# Altium schematic sheet MAX78630 SOC.SchDoc: MAX78630 SOC Core
size 393 x 292 mm; SheetNumber: 12; SheetTotal: 12
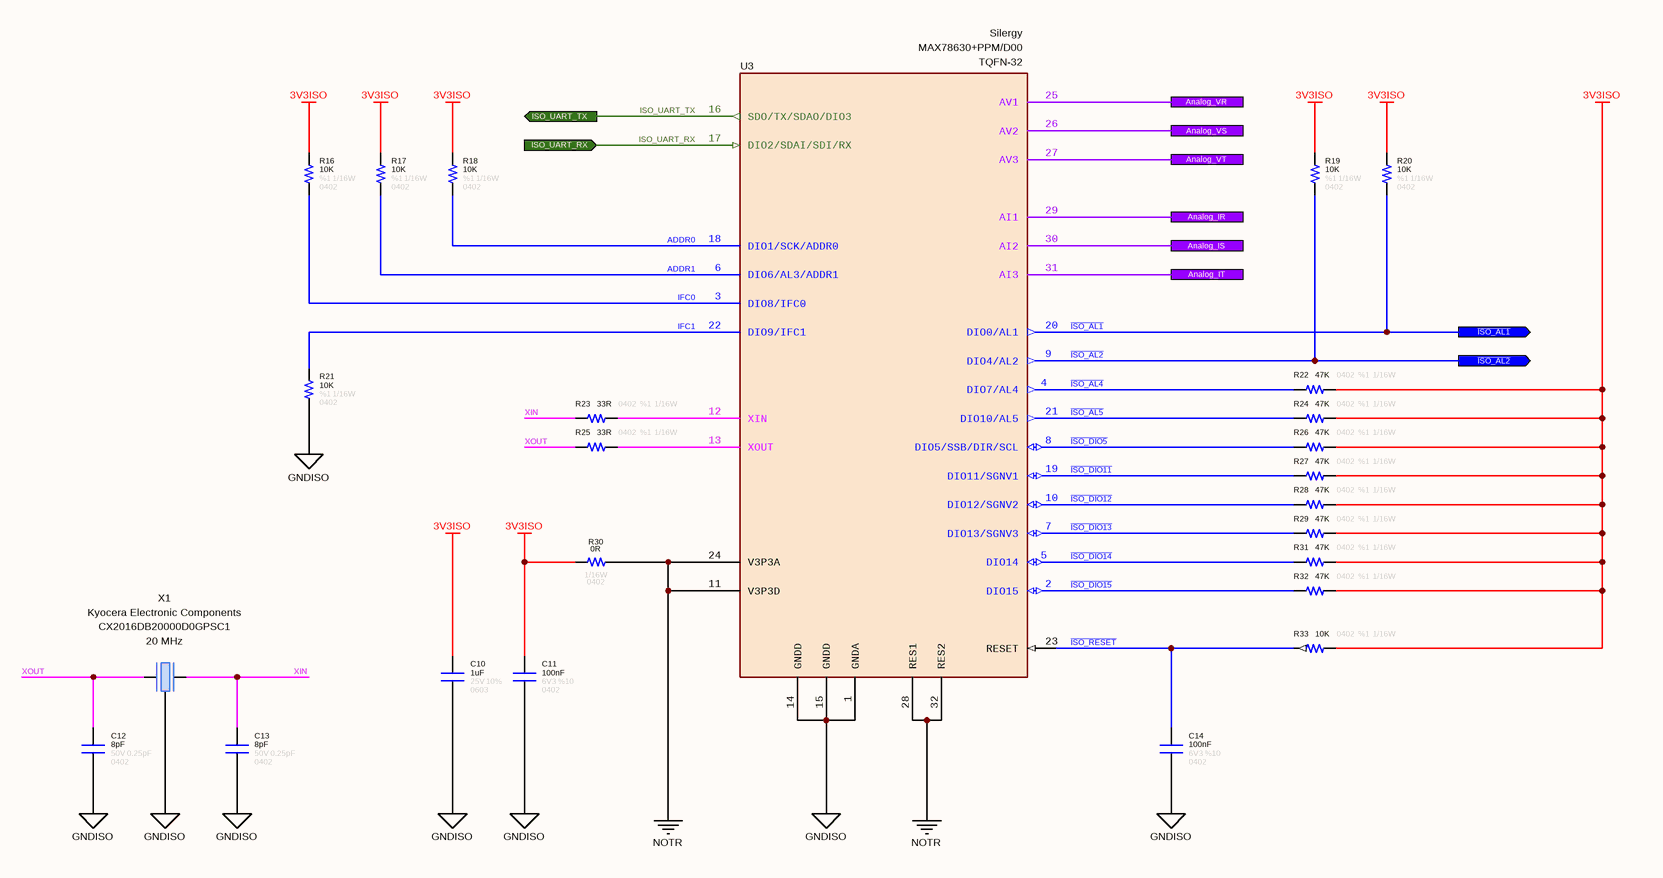
[diagram p0: MAX78630 SOC.SchDoc]

## Parts
C10  value 1uF  Tolerance: 10%  Case: 0603  Voltage: 25V  [CAPACITOR_0603]  (hidden comment: Capacitor - 1uF [0603] (MLCC))
C11  value 100nF  Tolerance: %10  Voltage: 6V3  Case: 0402  [CAPACITOR_0402]  (hidden comment: Capacitor - 100nF [0402] (Ceramic))
C12  value 8pF  Tolerance: 0.25pF  Case: 0402  Voltage: 50V  [CAPACITOR_0402]  (hidden comment: Capacitor - 8pF [0402] (Ceramic))
C13  value 8pF  Tolerance: 0.25pF  Case: 0402  Voltage: 50V  [CAPACITOR_0402]  (hidden comment: Capacitor - 8pF [0402] (Ceramic))
C14  value 100nF  Tolerance: %10  Voltage: 6V3  Case: 0402  [CAPACITOR_0402]  (hidden comment: Capacitor - 100nF [0402] (Ceramic))
R16  value 10K  Tolerance: %1  Case: 0402  Power: 1/16W  [RESISTOR_0402]  (hidden comment: 10K - 0402 - %1 - 1/16W)
R17  value 10K  Tolerance: %1  Case: 0402  Power: 1/16W  [RESISTOR_0402]  (hidden comment: 10K - 0402 - %1 - 1/16W)
R18  value 10K  Tolerance: %1  Case: 0402  Power: 1/16W  [RESISTOR_0402]  (hidden comment: 10K - 0402 - %1 - 1/16W)
R19  value 10K  Tolerance: %1  Case: 0402  Power: 1/16W  [RESISTOR_0402]  (hidden comment: 10K - 0402 - %1 - 1/16W)
R20  value 10K  Tolerance: %1  Case: 0402  Power: 1/16W  [RESISTOR_0402]  (hidden comment: 10K - 0402 - %1 - 1/16W)
R21  value 10K  Tolerance: %1  Case: 0402  Power: 1/16W  [RESISTOR_0402]  (hidden comment: 10K - 0402 - %1 - 1/16W)
R22  value 47K  Tolerance: %1  Case: 0402  Power: 1/16W  [RESISTOR_0402]  (hidden comment: 47K - 0402 - %1 - 1/16W)
R23  value 33R  Case: 0402  Tolerance: %1  Power: 1/16W  [RESISTOR_0402]  (hidden comment: 33R - 0402 - %1 - 1/16W)
R24  value 47K  Tolerance: %1  Case: 0402  Power: 1/16W  [RESISTOR_0402]  (hidden comment: 47K - 0402 - %1 - 1/16W)
R25  value 33R  Case: 0402  Tolerance: %1  Power: 1/16W  [RESISTOR_0402]  (hidden comment: 33R - 0402 - %1 - 1/16W)
R26  value 47K  Tolerance: %1  Case: 0402  Power: 1/16W  [RESISTOR_0402]  (hidden comment: 47K - 0402 - %1 - 1/16W)
R27  value 47K  Tolerance: %1  Case: 0402  Power: 1/16W  [RESISTOR_0402]  (hidden comment: 47K - 0402 - %1 - 1/16W)
R28  value 47K  Tolerance: %1  Case: 0402  Power: 1/16W  [RESISTOR_0402]  (hidden comment: 47K - 0402 - %1 - 1/16W)
R29  value 47K  Tolerance: %1  Case: 0402  Power: 1/16W  [RESISTOR_0402]  (hidden comment: 47K - 0402 - %1 - 1/16W)
R30  value 0R  Case: 0402  Power: 1/16W  [RESISTOR_0402]  (hidden comment: 0R - 0402 - %1 - 1/16W)
R31  value 47K  Tolerance: %1  Case: 0402  Power: 1/16W  [RESISTOR_0402]  (hidden comment: 47K - 0402 - %1 - 1/16W)
R32  value 47K  Tolerance: %1  Case: 0402  Power: 1/16W  [RESISTOR_0402]  (hidden comment: 47K - 0402 - %1 - 1/16W)
R33  value 10K  Tolerance: %1  Case: 0402  Power: 1/16W  [RESISTOR_0402]  (hidden comment: 10K - 0402 - %1 - 1/16W)
U3  Manufacturer Name: Silergy  Case: TQFN-32  [TQFN-32 - Maxim]  (hidden comment: MAX78630+PPM/D00)
X1  Manufacturer Name: Kyocera Electronic Components  Frequency: 20 MHz  [CRYSTAL - 20MHz]  (hidden comment: CX2016DB20000D0GPSC1)

## Ports
Analog_IR, Analog_IS, Analog_IT, Analog_VR, Analog_VS, Analog_VT, ISO_UART_RX (in), ISO_UART_TX (out), ~{ISO_AL1} (out), ~{ISO_AL2} (out)

## Nets
3V3ISO: C10.2 C11.2 R16.2 R17.2 R18.2 R19.2 R20.2 R22.1 R24.1 R26.1 R27.1 R28.1 R29.1 R30.2 R31.1 R32.1 R33.1
GNDISO: C10.1 C11.1 C12.1 C13.1 C14.1 R21.1 U3.1(GNDA) U3.14(GNDD) U3.15(GNDD) X1.2(GND)
NOTR: R30.1 U3.11(V3P3D) U3.24(V3P3A) U3.28(RES1) U3.32(RES2)
ADDR0: R18.1 U3.18(DIO1/SCK/ADDR0)
ADDR1: R17.1 U3.6(DIO6/AL3/ADDR1)
Analog_IR: U3.29(AI1) ; port Analog_IR
Analog_IS: U3.30(AI2) ; port Analog_IS
Analog_IT: U3.31(AI3) ; port Analog_IT
Analog_VR: U3.25(AV1) ; port Analog_VR
Analog_VS: U3.26(AV2) ; port Analog_VS
Analog_VT: U3.27(AV3) ; port Analog_VT
~{ISO_AL1}: R20.1 U3.20(DIO0/AL1) ; port ~{ISO_AL1}
~{ISO_AL2}: R19.1 U3.9(DIO4/AL2) ; port ~{ISO_AL2}
~{ISO_AL4}: R22.2 U3.4(DIO7/AL4)
~{ISO_AL5}: R24.2 U3.21(DIO10/AL5)
~{ISO_DIO11}: R27.2 U3.19(DIO11/SGNV1)
~{ISO_DIO12}: R28.2 U3.10(DIO12/SGNV2)
~{ISO_DIO13}: R29.2 U3.7(DIO13/SGNV3)
~{ISO_DIO14}: R31.2 U3.5(DIO14)
~{ISO_DIO15}: R32.2 U3.2(DIO15)
~{ISO_DIO5}: R26.2 U3.8(DIO5/SSB/DIR/SCL)
~{ISO_RESET}: C14.2 R33.2 U3.23(RESET)
IFC0: R16.1 U3.3(DIO8/IFC0)
IFC1: R21.2 U3.22(DIO9/IFC1)
ISO_UART_RX: U3.17(DIO2/SDAI/SDI/RX) ; port ISO_UART_RX
ISO_UART_TX: U3.16(SDO/TX/SDAO/DIO3) ; port ISO_UART_TX
XIN: C13.2 R23.2 X1.1(IN/OUT)
XOUT: C12.2 R25.2 X1.3(OUT/IN)
NetR23_1: R23.1 U3.12(XIN)
NetR25_1: R25.1 U3.13(XOUT)

Not connected (* = marked no-connect by the designer): X1 4(GND)

## Notes on the sheet
- © 2021 All rights reserved.
  This document may not, in whole or in part, be copied, photocopied, reproduced, translated or converted to any electronic or machine readable from without prior written permission of Mehmet Günce Akkoyun.
  Engineer contact : akkoyun@me.com
- Property of
- Engineer :
- Date :
- Size :
- A4
- Time :
- Project :
- Page :
- /
- Customer :
- Product ID :
- Module ID :
- Version :
- File :
- Revision :

## Library data of the parts
C10 = Capacitor - 1uF [0603-25V]: Capacitor (MLCC) - 1uF / 25V / 0603; Manufacturer Part Number: GCJ188R71E105KA01D; Manufacturer Name: Murata Electronics; ComponentLink1Description: DataSheet; ComponentLink1URL: https://www.mouser.com.tr/datasheet/2/281/1/GCJ188R71E105KA01_02B-3140112.pdf; ComponentLink2Description: Mouser; ComponentLink2URL: https://www.mouser.com.tr/ProductDetail/Murata-Electronics/GCJ188R71E105KA01D?qs=rnuWwpjhhVuRpUqK416FbQ%3D%3D; Subcategory: Capacitors
C11 C14 = Capacitor - 100nF [0402-6V3]: Capacitor - 100nF [0402-6V3] (Ceramic); Manufacturer Name: AVX; Manufacturer Part Number: 04026D104KAT4A; ComponentLink1Description: Mouser; ComponentLink1URL: https://www.mouser.com.tr/ProductDetail/AVX/04026D104KAT4A?qs=sGAEpiMZZMs0AnBnWHyRQPg4iYkCw7IMED%2F4kpqgf7w%3D; ComponentLink2Description: DataSheet; ComponentLink2URL: https://www.mouser.com.tr/datasheet/2/40/cx5r-776519.pdf
C12 C13 = Capacitor - 8pF [0402-50V]: Manufacturer Name: KYOCERA AVX; Manufacturer Part Number: 04025A8R0CAT2A
R16-R21 R33 = Resistor - 10K [0402]: Thick Film Resistors - SMD 1/16 W 10 KOhm 1%; Manufacturer Name: Vishay; Manufacturer Part Number: CRCW040210K0FKED; ComponentLink1Description: DataSheet; ComponentLink1URL: https://www.mouser.com.tr/datasheet/2/427/dcrcwe3-1762152.pdf; ComponentLink2Description: Mouser; ComponentLink2URL: https://www.mouser.com.tr/ProductDetail/Vishay-Dale/CRCW040210K0FKED?qs=sGAEpiMZZMu61qfTUdNhG2DpbjADlD3GcalbOv9utCY%3D
R22 R24 R26-R29 R31 R32 = Resistor - 47K [0402]: Thick Film Resistors - SMD 1/16 W 47 KOhm 1%; Manufacturer Name: Vishay; Manufacturer Part Number: CRCW040247K0FKED; ComponentLink1Description: DataSheet; ComponentLink1URL: https://www.mouser.com.tr/datasheet/2/427/dcrcwe3-1762152.pdf; ComponentLink2Description: Mouser; ComponentLink2URL: https://www.mouser.com.tr/ProductDetail/Vishay-Dale/CRCW040247K0FKED?qs=sGAEpiMZZMu61qfTUdNhG2DpbjADlD3GL%252B3h1elTxqU%3D
R23 R25 = Resistor - 33R [0402]: Thick Film Resistors - SMD 1/16 W 33 Ohm 1%; Manufacturer Name: Vishay; Manufacturer Part Number: CRCW040233R0FKED; ComponentLink1Description: DataSheet; ComponentLink1URL: https://www.mouser.com.tr/datasheet/2/427/dcrcwe3-1762152.pdf; ComponentLink2Description: Mouser; ComponentLink2URL: https://www.mouser.com.tr/ProductDetail/Vishay-Dale/CRCW0402330RFKED?qs=sGAEpiMZZMu61qfTUdNhG2DpbjADlD3GGS6SwBlLi5Q%3D
R30 = Resistor - 0R [0402]: Thick Film Resistors - SMD 1/16 W 0 Ohm; Manufacturer Name: Vishay; Manufacturer Part Number: CRCW04020000Z0ED; ComponentLink1Description: DataSheet; ComponentLink1URL: https://www.mouser.com.tr/datasheet/2/427/dcrcwe3-1762152.pdf; ComponentLink2Description: Mouser; ComponentLink2URL: https://www.mouser.com.tr/ProductDetail/Vishay-Dale/CRCW04020000Z0ED?qs=sGAEpiMZZMu61qfTUdNhG2DpbjADlD3GG34cJb50zyg%3D
U3 = IC - MAX78630: Energy Measurement Processor 32-Pin TQFN EP Tube; RoHS: Yes; Manufacturer Part Number: MAX78630+PPM/D00
X1 = Crystal - 20MHz: Crystals AEC-Q200 20000kHz 8pF 2x1.6mm; Case: SMD; Manufacturer Part Number: CX2016DB20000D0GPSC1